# Altium schematic sheet SCS_5V_RevA.SchDoc
size A3; _PRJ_TITLE: PROJECT TITLE; _SHT_TITLE: Sheet; _REV: A; PageSetup: Record=PageOptions|CenterHorizontal=True|CenterVertical=True|PrintScale=0.71|XCorrection=1.00|YCorrection=1.00|PrintKind=0|BorderSize=5000000|LeftOffset=0|BottomOffset=0|Orientation=2|PaperLength=1000|PaperWidth=1000|Scale=100|PaperSource=258|PrintQuality=600|MediaType=1|DitherType=10|PaperKind=A3 (297x420mm)|PrintScaleMode=1
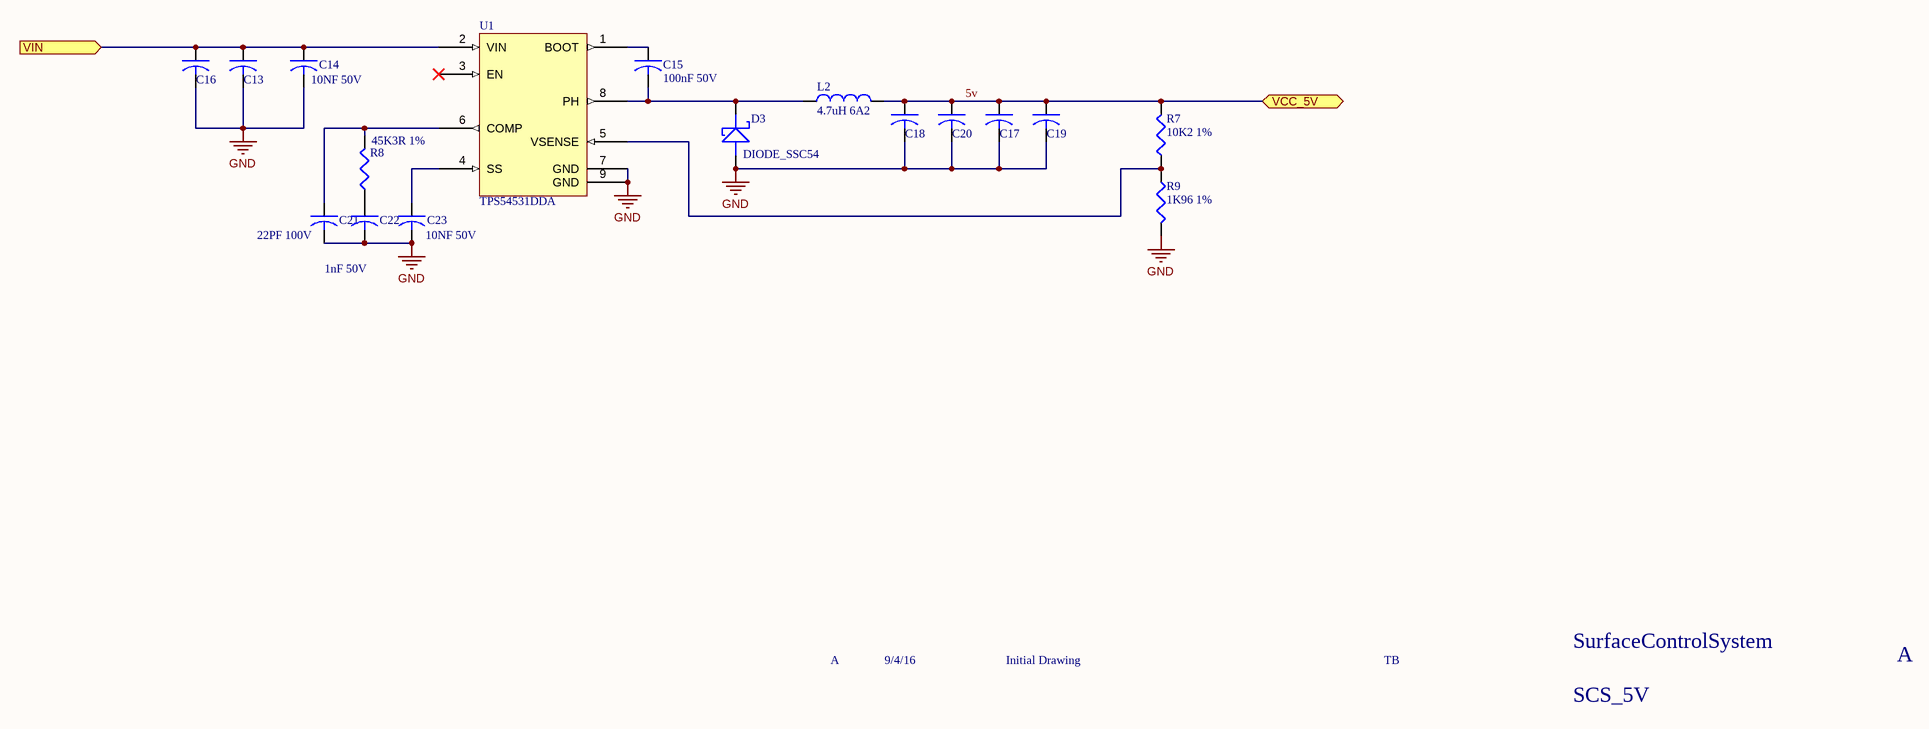
[diagram p0: SCS_5V_RevA.SchDoc]

## Parts
C13  10UF 25V  [1206]  (value not drawn)
C14  10NF 50V  [0603]
C15  100nF 50V  [0603]
C16  10UF 25V  [1206]  (value not drawn)
C17  10UF 25V  [1206]  (value not drawn)
C18  10UF 25V  [1206]  (value not drawn)
C19  10UF 25V  [1206]  (value not drawn)
C20  10UF 25V  [1206]  (value not drawn)
C21  22PF 100V  [0603]
C22  1nF 50V  [0603]
C23  10NF 50V  [0603]
D3  DIODE_SSC54  [DO-214AB]
L2  4.7uH 6A2  [Wurth744771156]
R7  10K2 1%  [0603]
R8  45K3R 1%  [0603]
R9  1K96 1%  [0603]
U1  TPS54531DDA  [PSOP-8]

## Ports
VCC_5V (bidir), VIN (in)

## Nets
GND: C13.2 C14.2 C16.2 C17.2 C18.2 C19.2 C20.2 C21.2 C22.2 C23.2 D3.A R9.2 U1.7(GND) U1.9(GND)
5v: C17.1 C18.1 C19.1 C20.1 L2.2 R7.2 ; port VCC_5V
VIN: C13.1 C14.1 C16.1 U1.2(VIN) ; port VIN
NetC15_1: C15.1 U1.1(BOOT)
NetC15_2: C15.2 D3.K L2.1 U1.8(PH)
NetC21_1: C21.1 R8.2 U1.6(COMP)
NetC22_1: C22.1 R8.1
NetC23_1: C23.1 U1.4(SS)
NetR7_1: R7.1 R9.1 U1.5(VSENSE)

Not connected (* = marked no-connect by the designer): U1 3(EN)*

## Notes on the sheet
- SurfaceControlSystem
- A
- 9/4/16
- Initial Drawing
- TB
- SCS_5V
- TEMPLATE MODIFIED 09/04/16
- PCBA REV
- DATE
- ECO
- DESCRIPTION
- DRAWN
- APPROVED
- FILE NAME
- PCB REVISION
- Sheet NAME
- SCALE
- SHEET
- NTS
- SHEET SIZE
- A3

## Library data of the parts
C13 C16-C20 = CAP_10UF_25V_10%_1206: CAP CER 10UF 25V 10% X5R 1206; Manufacturer: Murata; Manufacturer P/N: GRM319R61E106KA12D
C14 C23 = CAP_10NF_50V_10%_0603: CAP CER 10NF 50V 10% X7R 0603; Manufacturer: Murata; Manufacturer P/N: GRM188R71H103KA01D
C15 = CAP_100NF_50V_10%_0603: CAP CER 100nF 50V 10% X7R 0603; Manufacturer: Murata; Manufacturer P/N: GRM188R71H104KA93D
C21 = CAP_22PF_100V_5%_0603: CAP CER 22PF 100V 5% NP0 0603; Manufacturer: Murata; Manufacturer P/N: GRM1885C2A220JA01D
C22 = CAP_1NF_50V_10%_0603: CAP CER 1nF 50V 10% X7R 0603; Manufacturer: Murata; Manufacturer P/N: GRM188R71H102KA01D
D3 = DIODE_SSC54: Schottky Diode, 5A, 40V SSC54, DO214AB; Manufacturer: Vishay; Manufacturer P/N: SSC54-E3/9AT
L2 = IND_4.7uH_6A2: FIXED IND 4.7UH 6.2A 34 MOHM; Manufacturer: Wurth Electronics Inc; Manufacturer P/N: 74437356047
R7 = RES_10K2_1%_0603: Resistor, 10K2, 1%, 0603; Manufacturer: Yageo; Manufacturer P/N: RC0603FR-0710K2L
R8 = RES_45K3_1%_0603: Resistor, 45K3, 1%, 0603; Manufacturer: Bourns Inc; Manufacturer P/N: CR0603-FX-4532ELF
R9 = RES_1K96_1%_0603: Resistor, 1K96, 1%, 0603; Manufacturer: Yageo; Manufacturer P/N: RC0603FR-071K96L
U1 = IC_SMPS_TPS54531: SMPS; Manufacturer: TI; Manufacturer P/N: TPS54531DDA